# Altium schematic sheet BLE.SchDoc
size A
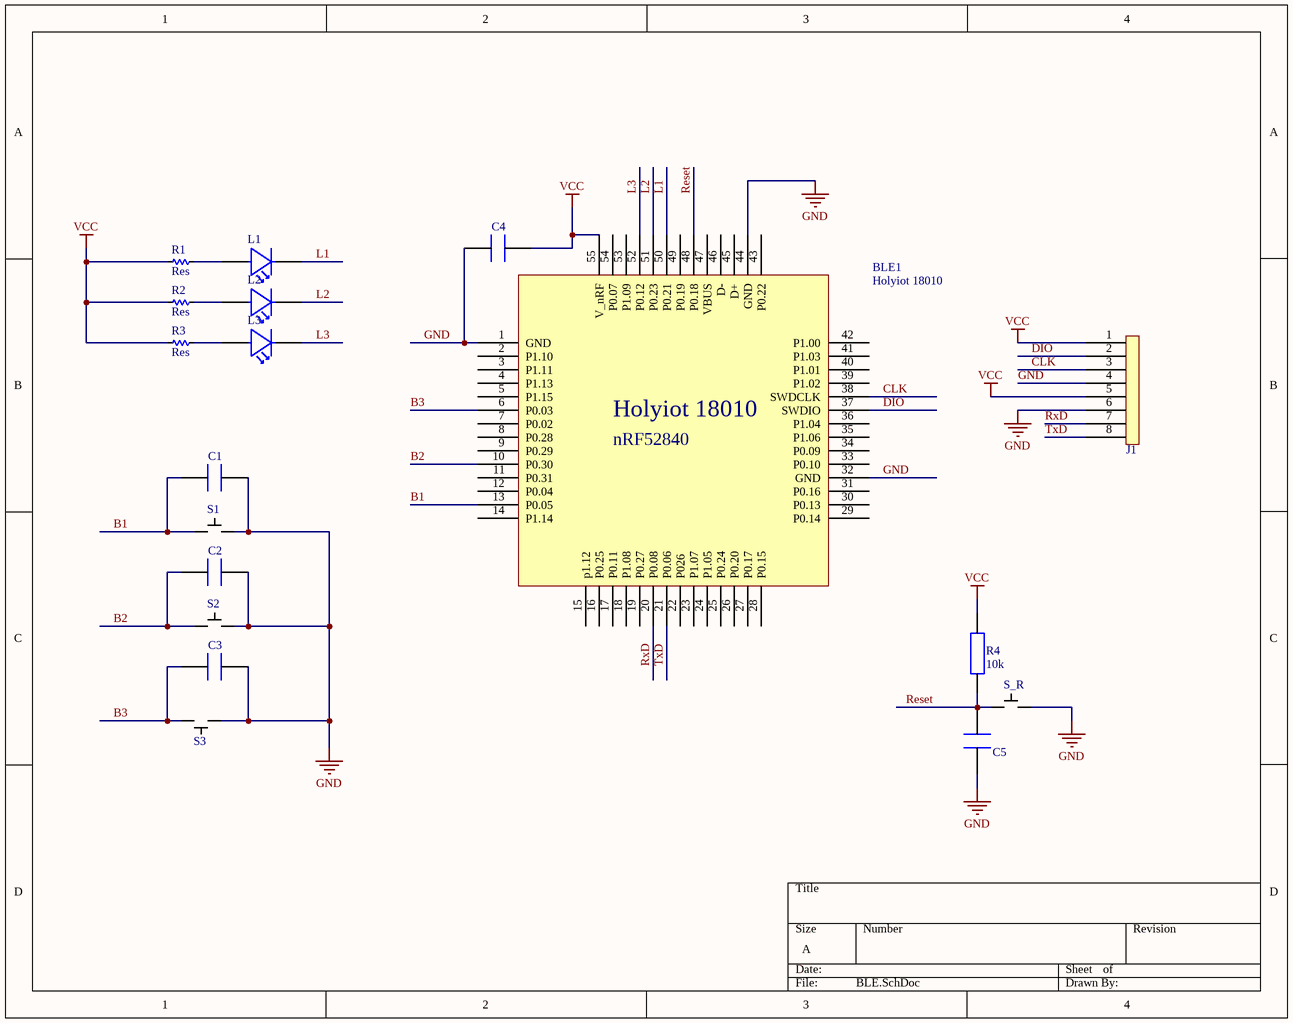
[diagram p0: BLE.SchDoc]

## Parts
BLE1  Holyiot 18010  [Holyiot 18010]
C1  Cap  [CAP-0805]  (value not drawn)
C2  Cap  [CAP-0805]  (value not drawn)
C3  Cap  [CAP-0805]  (value not drawn)
C4  Cap  [CAP-0805]  (value not drawn)
C5  Cap  [CAP-0805]  (value not drawn)
J1  JP_8  [JP_8]  (value not drawn)
L1  LED  [LED0805]  (value not drawn)
L2  LED  [LED0805]  (value not drawn)
L3  LED  [LED0805]  (value not drawn)
R1  Res  [RES-SMD-0805]
R2  Res  [RES-SMD-0805]
R3  Res  [RES-SMD-0805]
R4  10k  [RES0805]
S1  Button  [button_smd]  (value not drawn)
S2  Button  [button_smd]  (value not drawn)
S3  Button  [button_smd]  (value not drawn)
S_R  Button  [button_smd]  (value not drawn)

## Nets
GND: BLE1.1(GND) BLE1.32(GND) BLE1.44(GND) C1.2 C2.2 C3.2 C4.1 C5.1 J1.4 J1.6 S1.2 S2.2 S3.1 S_R.2
VCC: BLE1.55(V_nRF) C4.2 J1.1 J1.5 R1.2 R2.2 R3.2 R4.2
B1: BLE1.13(P0.05) C1.1 S1.1
B2: BLE1.10(P0.30) C2.1 S2.1
B3: BLE1.6(P0.03) C3.1 S3.2
CLK: BLE1.38(SWDCLK) J1.3
DIO: BLE1.37(SWDIO) J1.2
L1: BLE1.50(P0.21) L1.C
L2: BLE1.51(P0.23) L2.C
L3: BLE1.52(P0.12) L3.C
Reset: BLE1.48(P0.18) C5.2 R4.1 S_R.1
RxD: BLE1.20(P0.08) J1.7
TxD: BLE1.21(P0.06) J1.8
NetL1_A: L1.A R1.1
NetL2_A: L2.A R2.1
NetL3_A: L3.A R3.1

Not connected (* = marked no-connect by the designer): BLE1 2(P1.10) 3(P1.11) 4(P1.13) 5(P1.15) 7(P0.02) 8(P0.28) 9(P0.29) 11(P0.31) 12(P0.04) 14(P1.14) 15(p1.12) 16(P0.25) 17(P0.11) 18(P1.08) 19(P0.27) 22(P026) 23(P1.07) 24(P1.05) 25(P0.24) 26(P0.20) 27(P0.17) 28(P0.15) 29(P0.14) 30(P0.13) 31(P0.16) 33(P0.10) 34(P0.09) 35(P1.06) 36(P1.04) 39(P1.02) 40(P1.01) 41(P1.03) 42(P1.00) 43(P0.22) 45(D+) 46(D-) 47(VBUS) 49(P0.19) 53(P1.09) 54(P0.07)

## Notes on the sheet
- (in symbol Holyiot 18010) nRF52840

## Library data of the parts
BLE1 = Holyiot 18010: Holyiot 18010 Bắc Âu nRF52840 module Bluetooth mô-đun năng lượng thấp hội đồng phát triển cho BLE lưới bluetooth 5
R1-R3 = Res-SMD: Resistor; Manufacturer: Generic Components; Class: Passive; Published: 08/06/2000; Publisher: Altium Hobart Technology Centre
R4 = RES: điện trở size nhỏ